# Altium schematic sheet 03_RADIO.SchDoc
size A4
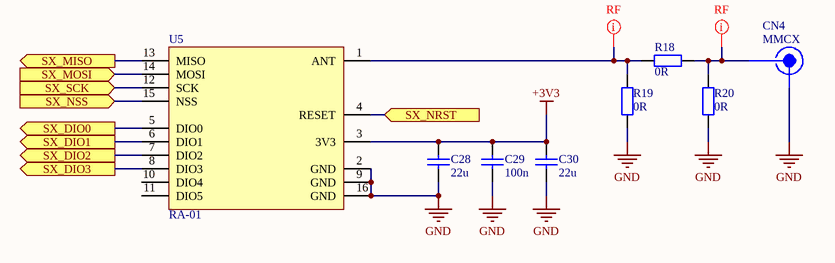
[diagram p0: 03_RADIO.SchDoc]

## Parts
C28  22u  [C0805_IPC_MD]
C29  100n  [C0603_IPC_MD]
C30  22u  [C0805_IPC_MD]
CN4  MMCX  [MMCX_EDGE]
R18  0R  [R0603_IPC_MD]
R19  0R  [R0603_IPC_MD]  (no BOM)
R20  0R  [R0603_IPC_MD]  (no BOM)
U5  RA-01  [RA-01]

## Ports
SX_DIO0 (out), SX_DIO1 (out), SX_DIO2 (out), SX_DIO3 (out), SX_MISO (out), SX_MOSI (in), SX_NRST (in), SX_NSS (in), SX_SCK (in)

## Nets
+3V3: C28.1 C29.1 C30.1 U5.3(3V3)
GND: C28.2 C29.2 C30.2 CN4.1 R19.1 R20.1 U5.2(GND) U5.9(GND) U5.16(GND)
SX_DIO0: U5.5(DIO0) ; port SX_DIO0
SX_DIO1: U5.6(DIO1) ; port SX_DIO1
SX_DIO2: U5.7(DIO2) ; port SX_DIO2
SX_DIO3: U5.8(DIO3) ; port SX_DIO3
SX_MISO: U5.13(MISO) ; port SX_MISO
SX_MOSI: U5.14(MOSI) ; port SX_MOSI
SX_NRST: U5.4(RESET) ; port SX_NRST
SX_NSS: U5.15(NSS) ; port SX_NSS
SX_SCK: U5.12(SCK) ; port SX_SCK
NetCN4_2: CN4.2 R18.2 R20.2
NetR18_1: R18.1 R19.2 U5.1(ANT)

Not connected (* = marked no-connect by the designer): U5 10(DIO4) 11(DIO5)

## Layout directives
net class RF50: NetCN4_2, NetR18_1

## Library data of the parts
C28 C30 = CL21A226MOCLRNC: CAP CER 22UF 16V X5R 0805; Manufacturer: Samsung Electro-Mechanics; Manufacturer Part Number: CL21A226MOCLRNC; Voltage: 16V; Value: 22u; Dielectric: X5R; Supplier 1: Digi-Key; Supplier Part Number 1: 1276-6780-1-ND
C29 = CL10B104KO8WPNC: CAP CER 0.1UF 16V X7R 0603; Manufacturer: Samsung Electro-Mechanics; Manufacturer Part Number: CL10B104KO8WPNC; Voltage: 16V; Value: 100n; Dielectric: X7R; Supplier 1: Digi-Key; Supplier Part Number 1: 1276-6582-1-ND
CN4 = MMCX: MMCX PCB EDGE CONN; Manufacturer: China; Manufacturer Part Number: MMCX; Supplier 1: Aliexpress; Supplier Part Number 1: MMCX
R18-R20 = CR0603-J/-000ELF: RES SMD 0 OHM JUMPER 1/10W 0603; Manufacturer: Bourns Inc.; Tolarance: 1%; Value: 0R; Manufacturer Part Number: CR0603-J/-000ELF; Supplier 1: Digi-Key; Supplier Part Number 1: CR0603-J/-000ELFCT-ND
U5 = RA-01: Wireless Modules SX1278; Manufacturer: Ai-Thinker; Manufacturer Part Number: RA-01; Supplier 1: LCSC; Supplier Part Number 1: C90040